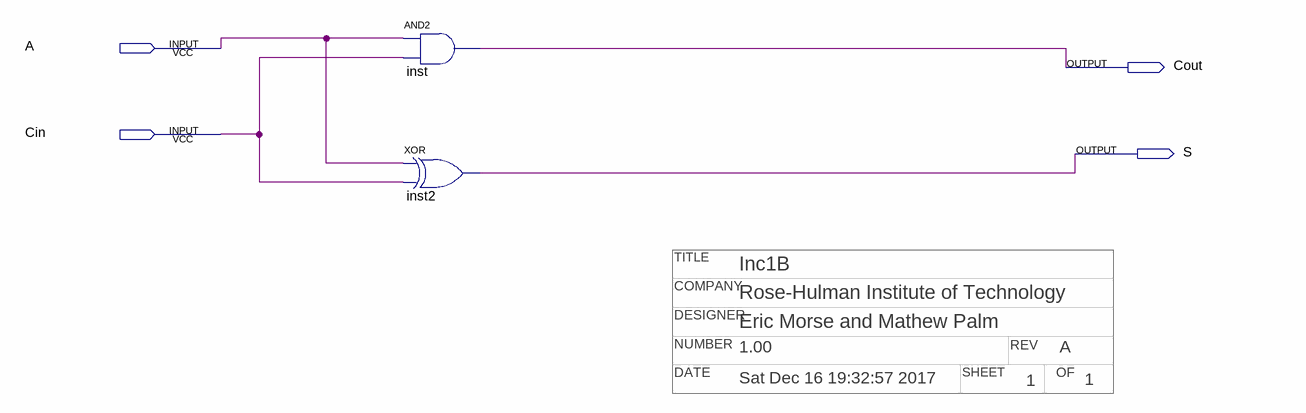
[diagram p0: schematic sheet]
// Quartus schematic inc1b.bdf as structural Verilog: 2 symbols, 4 pins
// Title block: COMPANY: Rose-Hulman Institute of Technology; DATE: Sat Dec 16 19:32:57 2017; DESIGNER: Eric Morse and Mathew Palm; NUMBER: 1.00; OF: 1; REV: A; SHEET: 1; TITLE: Inc1B
module inc1b (
  input  A,
  input  Cin,
  output Cout,
  output S
);

  and inst (Cout, A, Cin);
  xor inst2 (S, A, Cin);
endmodule
